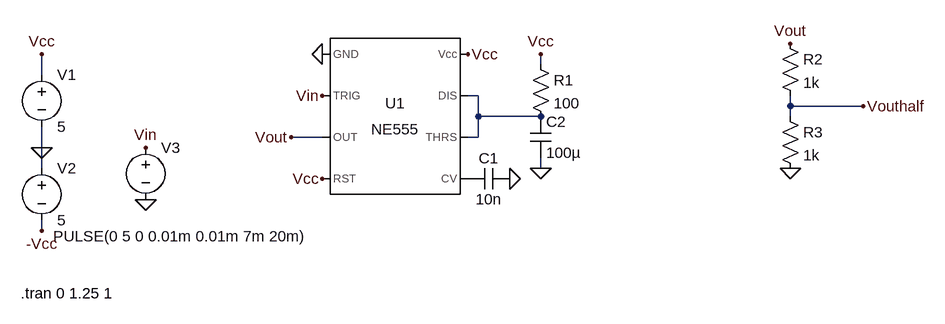
[diagram p0: schematic one shot.asc]
one shot.asc, the LTspice schematic file:
Version 4
SHEET 1 916 680
WIRE 304 -32 304 -48
WIRE -464 -16 -464 -48
WIRE 208 16 192 16
WIRE 688 32 688 16
WIRE 800 32 688 32
WIRE 208 48 208 16
WIRE 304 48 208 48
WIRE 688 48 688 32
WIRE -32 80 -80 80
WIRE 208 80 208 48
WIRE 208 80 192 80
WIRE -464 96 -464 64
WIRE -464 128 -464 96
WIRE 304 128 304 112
WIRE -464 224 -464 208
FLAG -32 -48 0
FLAG -464 96 0
FLAG -464 -48 Vcc
FLAG 192 -48 Vcc
FLAG -464 224 -Vcc
FLAG -304 176 0
FLAG -304 96 Vin
FLAG -32 16 Vin
FLAG -80 80 Vout
FLAG 256 144 0
FLAG -32 144 Vcc
FLAG 304 128 0
FLAG 304 -48 Vcc
FLAG 688 -64 Vout
FLAG 688 128 0
FLAG 800 32 Vouthalf
SYMBOL Misc\\NE555 80 48 R0
SYMATTR InstName U1
SYMBOL voltage -464 -32 R0
SYMATTR InstName V1
SYMATTR Value 5
SYMBOL voltage -464 112 R0
SYMATTR InstName V2
SYMATTR Value 5
SYMBOL voltage -304 80 R0
WINDOW 3 -142 152 Left 2
WINDOW 123 0 0 Left 0
WINDOW 39 0 0 Left 0
SYMATTR Value PULSE(0 5 0 0.01m 0.01m 7m 20m)
SYMATTR InstName V3
SYMBOL cap 256 128 R90
WINDOW 0 0 32 VBottom 2
WINDOW 3 32 32 VTop 2
SYMATTR InstName C1
SYMATTR Value 10n
SYMBOL cap 288 48 R0
SYMATTR InstName C2
SYMATTR Value 100µ
SYMBOL res 288 -48 R0
SYMATTR InstName R1
SYMATTR Value 100
SYMBOL res 672 -80 R0
SYMATTR InstName R2
SYMATTR Value 1k
SYMBOL res 672 32 R0
SYMATTR InstName R3
SYMATTR Value 1k
TEXT -496 320 Left 2 !.tran 0 1.25 1

The netlist it stands for:
* one shot.asc
XU1 0 Vin Vout Vcc P001 N001 N001 Vcc NE555  ; pins GND TRIG OUT RST CV THRS DIS Vcc
V1 Vcc 0 5
V2 0 -Vcc 5
V3 Vin 0 PULSE(0 5 0 0.01m 0.01m 7m 20m)
C1 0 P001 10n
C2 N001 0 100µ
R1 Vcc N001 100
R2 Vout Vouthalf 1k
R3 Vouthalf 0 1k
.tran 0 1.25 1
.lib NE555.sub
.backanno
.end